# EAGLE schematic Pedal Box Board rev0 (EAGLE 7.6.0)
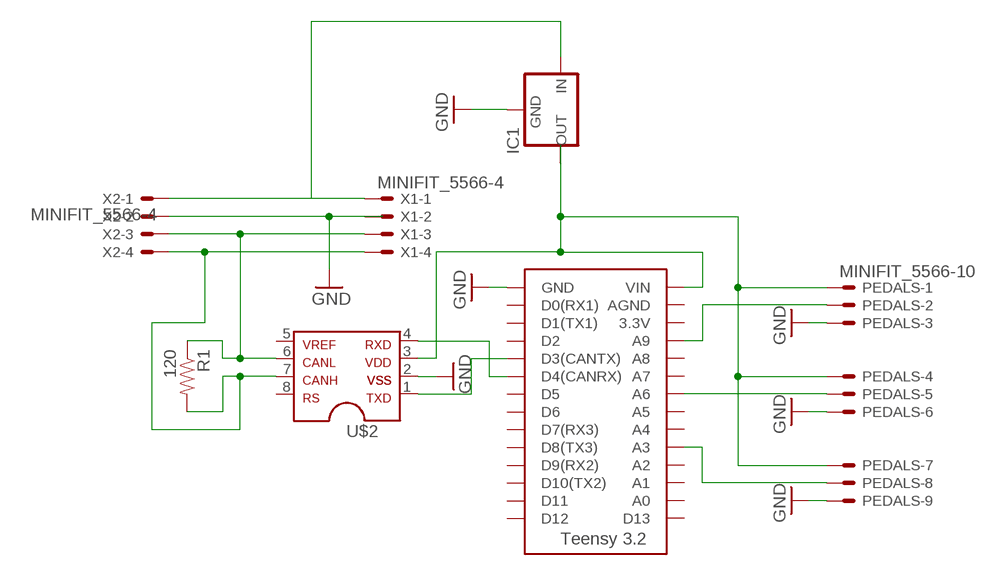
[diagram p0: schematic, sheet 1]

## Parts
IC1  5V_REGULATOR_LM340-NLM340MPX-5.0/NOPB  [SOT223]
PEDALS  MINIFIT_5566-10  [MINIFIT_5566-10]
R1  120  RESISTOR0805-RES  [0805]
U$1  TEENSY_3.2_SIMPLE  [TEENSY_3.2_SIMPLE]
U$2  MCP2551SOIC  [SOIC08]
X1  MINIFIT_5566-4  [MINIFIT_5566-4]
X2  MINIFIT_5566-4  [MINIFIT_5566-4]

## Nets
GND: IC1.2(GND) IC1.4(GND) PEDALS.3 PEDALS.6 PEDALS.9 U$1.GND U$2.2 X2.2
N$1: R1.2 U$2.7 X1.4 X2.4
N$2: R1.1 U$2.6 X1.3 X2.3
N$3: PEDALS.2 U$1.A9
N$4: IC1.1(IN) X1.1 X2.1
N$5: PEDALS.5 U$1.A6
N$6: PEDALS.8 U$1.A3
N$7: PEDALS.1 PEDALS.4 PEDALS.7 U$1.VIN U$2.3
N$8: U$1.D4(CANRX) U$2.4
N$9: U$1.D3(CANTX) U$2.1
Unconnected: IC1.3(OUT) PEDALS.10 U$1.3.3V U$1.A0 U$1.A1 U$1.A2 U$1.A4 U$1.A5 U$1.A7 U$1.A8 U$1.AGND U$1.D0(RX1) U$1.D1(TX1) U$1.D2 U$1.D5 U$1.D6 U$1.D7(RX3) U$1.D8(TX3) U$1.D9(RX2) U$1.D10(TX2) U$1.D11 U$1.D12 U$1.D13 U$2.5 U$2.8 X1.2

## Library data of the parts
IC1 = HyTechDevices:5V_REGULATOR_LM340-N: Voltage Regulator 5v linear voltage regulator Datasheet <http://www.mouser.com/ProductDetail/Texas-Instruments/LM340MPX-50-NOPB/?qs=X1J7HmVL2ZGZwtTFRQ9ItA%3D%3D> MAX current out: 1.5A MAX voltage in: 35V
PEDALS = HyTechDevices:MINIFIT_5566-10: Mini FIT Junior connector 10 pole Source: http://www.molex.com; OC_FARNELL: unknown; OC_NEWARK: unknown
R1 = HyTechDevices:RESISTOR: Resistor Basic schematic elements and footprints for 0603, 1206, and PTH resistors.
U$1 = HyTechDevices:TEENSY_3.2_SIMPLE: Simple version of the Teensy 3.2 board that only uses the 2 main rows of pins, not the inner pins or the pins opposite the usb port.
U$2 = HyTechDevices:MCP2551: MCP2551 High-Speed CAN Transceiver Product Webpage <https://www.microchip.com/wwwproducts/en/MCP2551> Datasheet <http://ww1.microchip.com/downloads/en/DeviceDoc/21667f.pdf> This device is outdated It is replaced by MCP2561. Comparison Page <https://www.microchip.com/wwwproducts/ProductCompare/MCP2551/MCP2561> Product Webpage <https://www.microchip.com/wwwproducts/en/MCP2561> Datasheet <http://ww1.microchip.com/downloads/en/DeviceDoc/20005167C.pdf>
X1 X2 = HyTechDevices:MINIFIT_5566-4: Mini FIT Junior connector 4 pole Source: http://www.molex.com; OC_FARNELL: unknown; OC_NEWARK: unknown